# EAGLE design SparkFun_MP3_Breakout-VS1063 (EAGLE 7.2.0)
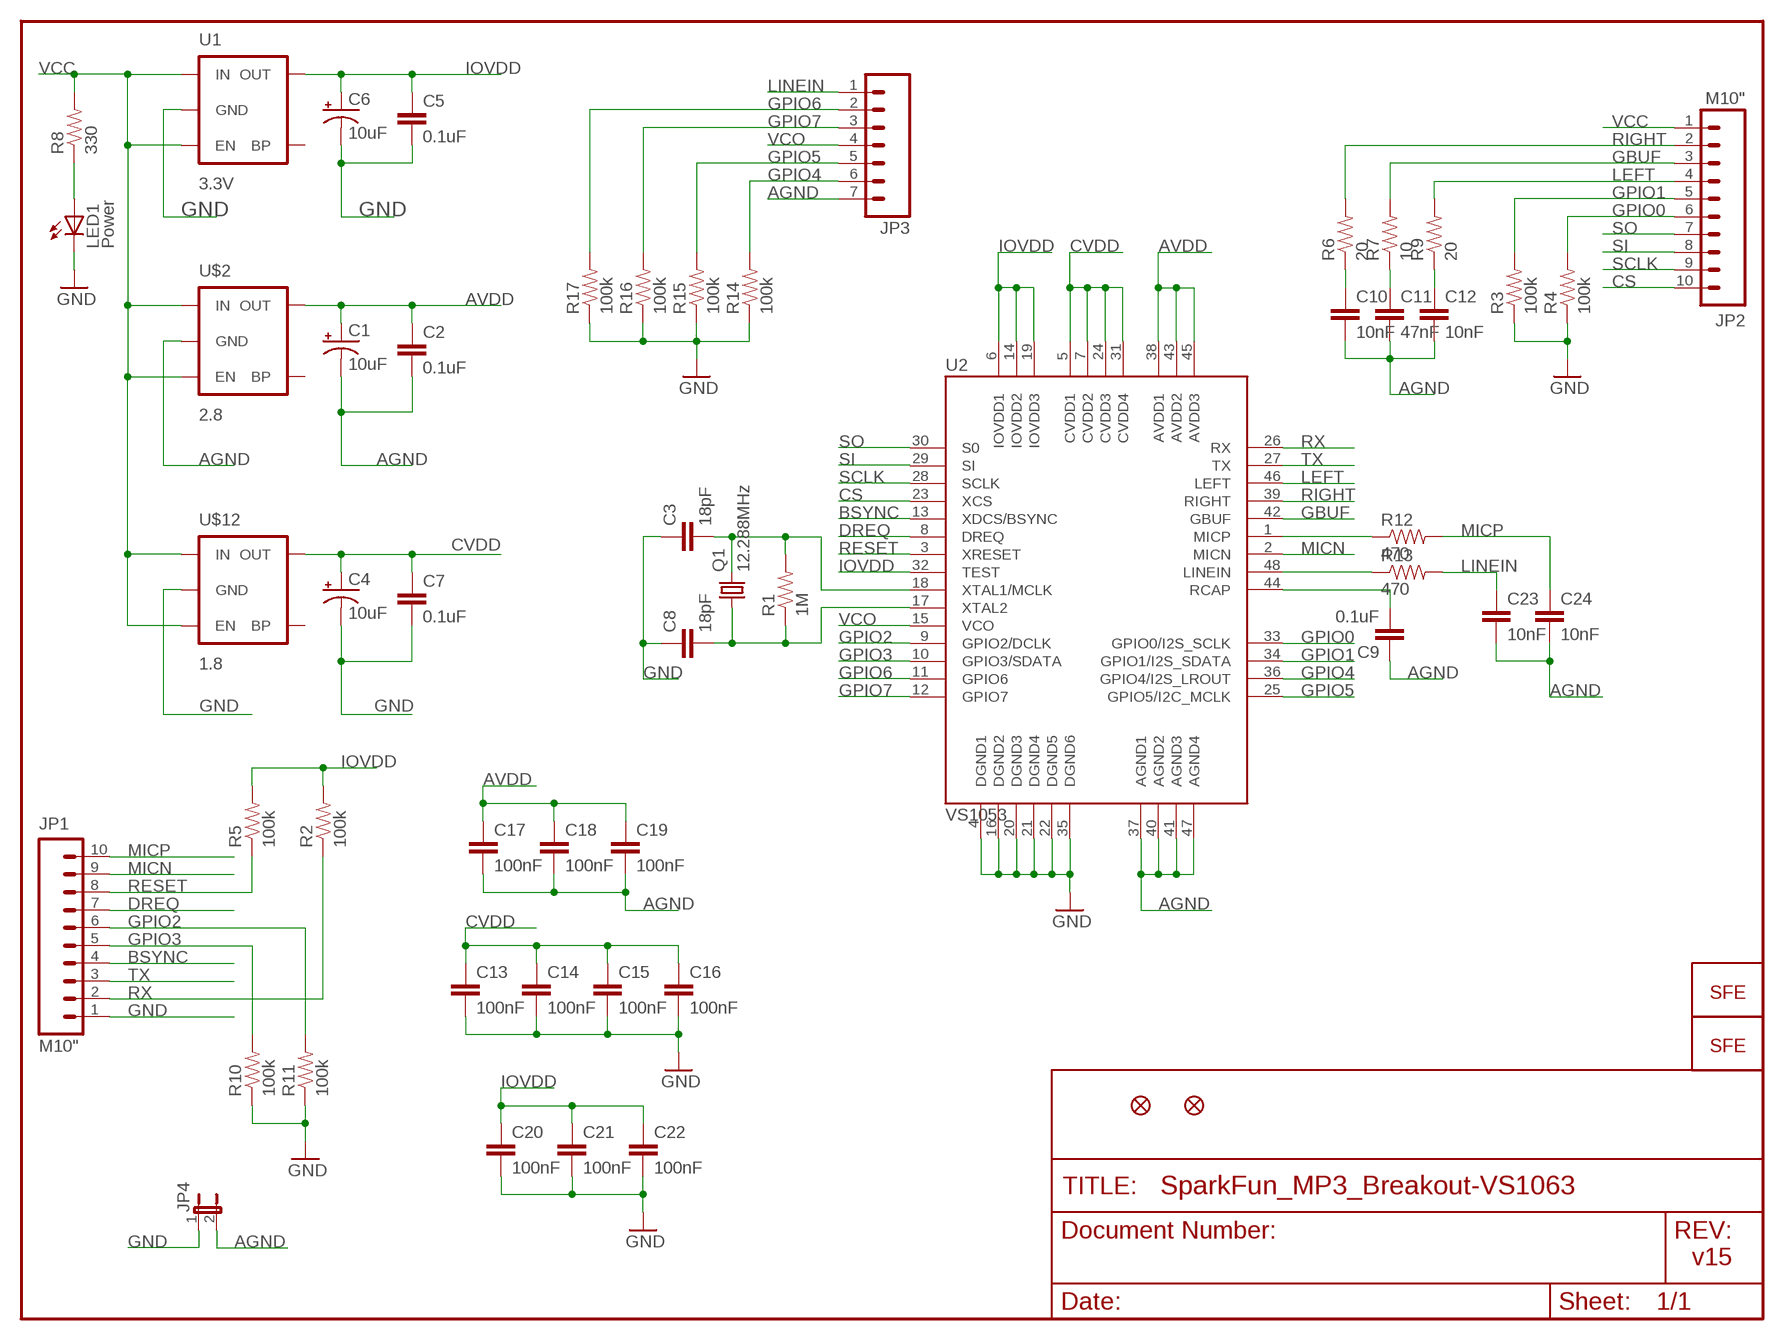
[diagram p0: schematic, sheet 1]

## Parts
C1  10uF  CAP_POL1206  [EIA3216]
C2  0.1uF  CAP0402-CAP  [0402-CAP]
C3  18pF  CAP0402-CAP  [0402-CAP]
C4  10uF  CAP_POL1206  [EIA3216]
C5  0.1uF  CAP0402-CAP  [0402-CAP]
C6  10uF  CAP_POL1206  [EIA3216]
C7  0.1uF  CAP0402-CAP  [0402-CAP]
C8  18pF  CAP0402-CAP  [0402-CAP]
C9  0.1uF  CAP0402-CAP  [0402-CAP]
C10  10nF  CAP0402-CAP  [0402-CAP]
C11  47nF  CAP0402-CAP  [0402-CAP]
C12  10nF  CAP0402-CAP  [0402-CAP]
C13  100nF  CAP0402-CAP  [0402-CAP]
C14  100nF  CAP0402-CAP  [0402-CAP]
C15  100nF  CAP0402-CAP  [0402-CAP]
C16  100nF  CAP0402-CAP  [0402-CAP]
C17  100nF  CAP0402-CAP  [0402-CAP]
C18  100nF  CAP0402-CAP  [0402-CAP]
C19  100nF  CAP0402-CAP  [0402-CAP]
C20  100nF  CAP0402-CAP  [0402-CAP]
C21  100nF  CAP0402-CAP  [0402-CAP]
C22  100nF  CAP0402-CAP  [0402-CAP]
C23  10nF  CAP0402-CAP  [0402-CAP]
C24  10nF  CAP0402-CAP  [0402-CAP]
JP1  M10"  [1X10]
JP2  M10"  [1X10]
JP3  M07  [1X07]
JP4  JUMPER-2SMD-NC  [SJ_2S]
LED1  Power  LED0603  [LED-0603]
Q1  12.288MHz  CRYSTAL5X3  [CRYSTAL-SMD-5X3]
R1  1M  RESISTOR0402-RES  [0402-RES]
R2  100k  RESISTOR0402-RES  [0402-RES]
R3  100k  RESISTOR0402-RES  [0402-RES]
R4  100k  RESISTOR0402-RES  [0402-RES]
R5  100k  RESISTOR0402-RES  [0402-RES]
R6  20  RESISTOR0402-RES  [0402-RES]
R7  10  RESISTOR0402-RES  [0402-RES]
R8  330  RESISTOR0402-RES  [0402-RES]
R9  20  RESISTOR0402-RES  [0402-RES]
R10  100k  RESISTOR0402-RES  [0402-RES]
R11  100k  RESISTOR0402-RES  [0402-RES]
R12  470  RESISTOR0402-RES  [0402-RES]
R13  470  RESISTOR0402-RES  [0402-RES]
R14  100k  RESISTOR0402-RES  [0402-RES]
R15  100k  RESISTOR0402-RES  [0402-RES]
R16  100k  RESISTOR0402-RES  [0402-RES]
R17  100k  RESISTOR0402-RES  [0402-RES]
U1  3.3V  V_REG_LDOSMD  [SOT23-5]
U2  VS1053  VS1033  [LQFP-48]
U$2  2.8  V_REG_LDOSMD2  [SC70]
U$4  FIDUCIAL1X2  [FIDUCIAL-1X2]
U$5  FIDUCIAL1X2  [FIDUCIAL-1X2]
U$6  LOGO-SFESK  [SFE-LOGO-FLAME]
U$7  LOGO-SFENEW  [SFE-NEW-WEBLOGO]
U$12  1.8  V_REG_LDOSMD2  [SC70]

## Nets
AGND: C1.C(-) C2.2 C9.1 C10.2 C11.2 C12.2 C17.2 C18.2 C19.2 C23.2 C24.2 JP3.7 JP4.2 U2.37(AGND1) U2.40(AGND2) U2.41(AGND3) U2.47(AGND4) U$2.2(GND)
AVDD: C1.A(+) C2.1 C17.1 C18.1 C19.1 U2.38(AVDD1) U2.43(AVDD2) U2.45(AVDD3) U$2.5(OUT)
BSYNC: JP1.4 U2.13(XDCS/BSYNC)
CS: JP2.10 U2.23(XCS)
CVDD: C4.A(+) C7.1 C13.1 C14.1 C15.1 C16.1 U2.5(CVDD1) U2.7(CVDD2) U2.24(CVDD3) U2.31(CVDD4) U$12.5(OUT)
DREQ: JP1.7 U2.8(DREQ)
GBUF: JP2.3 R7.2 U2.42(GBUF)
GND: C3.1 C4.C(-) C5.2 C6.C(-) C7.2 C8.1 C13.2 C14.2 C15.2 C16.2 C20.2 C21.2 C22.2 JP1.1 JP4.1 LED1.C R3.1 R4.1 R10.1 R11.1 R14.1 R15.1 R16.1 R17.1 U1.2(GND) U2.4(DGND1) U2.16(DGND2) U2.20(DGND3) U2.21(DGND4) U2.22(DGND5) U2.35(DGND6) U$12.2(GND)
GPIO0: JP2.6 R4.2 U2.33(GPIO0/I2S_SCLK)
GPIO1: JP2.5 R3.2 U2.34(GPIO1/I2S_SDATA)
GPIO2: JP1.6 R11.2 U2.9(GPIO2/DCLK)
GPIO3: JP1.5 R10.2 U2.10(GPIO3/SDATA)
GPIO4: JP3.6 R14.2 U2.36(GPIO4/I2S_LROUT)
GPIO5: JP3.5 R15.2 U2.25(GPIO5/I2C_MCLK)
GPIO6: JP3.2 R17.2 U2.11(GPIO6)
GPIO7: JP3.3 R16.2 U2.12(GPIO7)
IOVDD: C5.1 C6.A(+) C20.1 C21.1 C22.1 R2.2 R5.2 U1.5(OUT) U2.6(IOVDD1) U2.14(IOVDD2) U2.19(IOVDD3) U2.32(TEST)
LEFT: JP2.4 R9.2 U2.46(LEFT)
LINEIN: C23.1 JP3.1 R13.2
MICN: JP1.9 U2.2(MICN)
MICP: C24.1 JP1.10 R12.2
N$1: C9.2 U2.44(RCAP)
N$2: C12.1 R9.1
N$3: C10.1 R6.1
N$4: R12.1 U2.1(MICP)
N$5: C11.1 R7.1
N$6: LED1.A R8.1
N$7: R13.1 U2.48(LINEIN)
N$9: C3.2 Q1.3 R1.2 U2.18(XTAL1/MCLK)
N$10: C8.2 Q1.1 R1.1 U2.17(XTAL2)
RESET: JP1.8 R5.1 U2.3(XRESET)
RIGHT: JP2.2 R6.2 U2.39(RIGHT)
RX: JP1.2 R2.1 U2.26(RX)
SCLK: JP2.9 U2.28(SCLK)
SI: JP2.8 U2.29(SI)
SO: JP2.7 U2.30(S0)
TX: JP1.3 U2.27(TX)
VCC: JP2.1 R8.2 U1.1(IN) U1.3(EN) U$2.1(IN) U$2.3(EN) U$12.1(IN) U$12.3(EN)
VCO: JP3.4 U2.15(VCO)
Unconnected: U1.4(BP) U$2.4(BP) U$12.4(BP)

## Notes on the sheet
- v15

## Library data of the parts
C1 C4 C6 = SparkFun:CAP_POL: Capacitor Polarized These are standard SMD and PTH capacitors. Normally 10uF, 47uF, and 100uF in electrolytic and tantalum varieties. Always verify the external diameter of the through hole cap, it varies with capacity, voltage, and manufacturer. The EIA devices should be standard.
C2 C3 C5 C7-C24 = SparkFun:CAP: Capacitor Standard 0603 ceramic capacitor, and 0.1" leaded capacitor.
JP1 JP2 = SparkFun:M10: Header 10 Standard 10-pin 0.1" header. Use with straight break away headers (SKU : PRT-00116), right angle break away headers (PRT-00553), swiss pins (PRT-00743), machine pins (PRT-00117), and female headers (PRT-00115).
JP3 = SparkFun:M07: Header 7 Standard 7-pin 0.1" header. Use with straight break away headers (SKU : PRT-00116), right angle break away headers (PRT-00553), swiss pins (PRT-00743), machine pins (PRT-00117), and female headers (PRT-00115). NOTES ON THE VARIANTS LOCK and LOCK_LONGPADS... This footprint was designed to help hold the alignment of a through-hole component (i.e. 7-pin header) while soldering it into place. You may notice that each hole has been shifted either up or down by 0.005 of an inch from it's more standard position (which is usually a perfectly straight line). This slight alteration caused the pins (the squares in the middle) to touch the edges of the holes. Because they are alternating, it causes a "brace" to hold the header in place. 0.005 has proven to be the perfect amount of "off-center" position when using our standard breakaway headers. Although looks a little odd when you look at the bare footprint, once you have a header in there, the alteration is very hard to notice. Also, if you push a header all the way into place, it is covered up entirely on the bottom side. This idea of altering the position of holes to aid alignment will be further integrated into the Sparkfun Library for other footprints. It can help hold any component with 3 or more connection pins.
JP4 = SparkFun:JUMPER-2: Jumper Basic 0.1" spaced jumper. Use with breakaway headers.
LED1 = SparkFun:LED: LEDs Standard schematic elements and footprints for 5mm, 3mm, 1206, and 0603 sized LEDs. 5mm - Spark Fun Electronics SKU : COM-00529 (and others)
Q1 = SparkFun:CRYSTAL: Crystals Various standard crystals. Proven footprints. Spark Fun Electronics SKU : COM-00534
R1-R17 = SparkFun:RESISTOR: Resistor Basic schematic elements and footprints for 0603, 1206, and PTH resistors.
U1 U$2 U$12 = SparkFun:V_REG_LDO: Voltage Regulator LDO Standard 150mA LDO voltage regulator in SOT-23 layout. Micrel part MIC5205. BP (by-pass) pin is used to lower output noise with 470pF cap.
U2 = SparkFun:VS1033
U$4 U$5 = SparkFun:FIDUCIAL: Fiducial Alignment Points Various fiducial points for machine vision alignment.
U$6 U$7 = SparkFun:LOGO-SFE: Spark Fun Electronics PCB Logo This is the standard Spark Fun Electronics PCB logo.

## Board
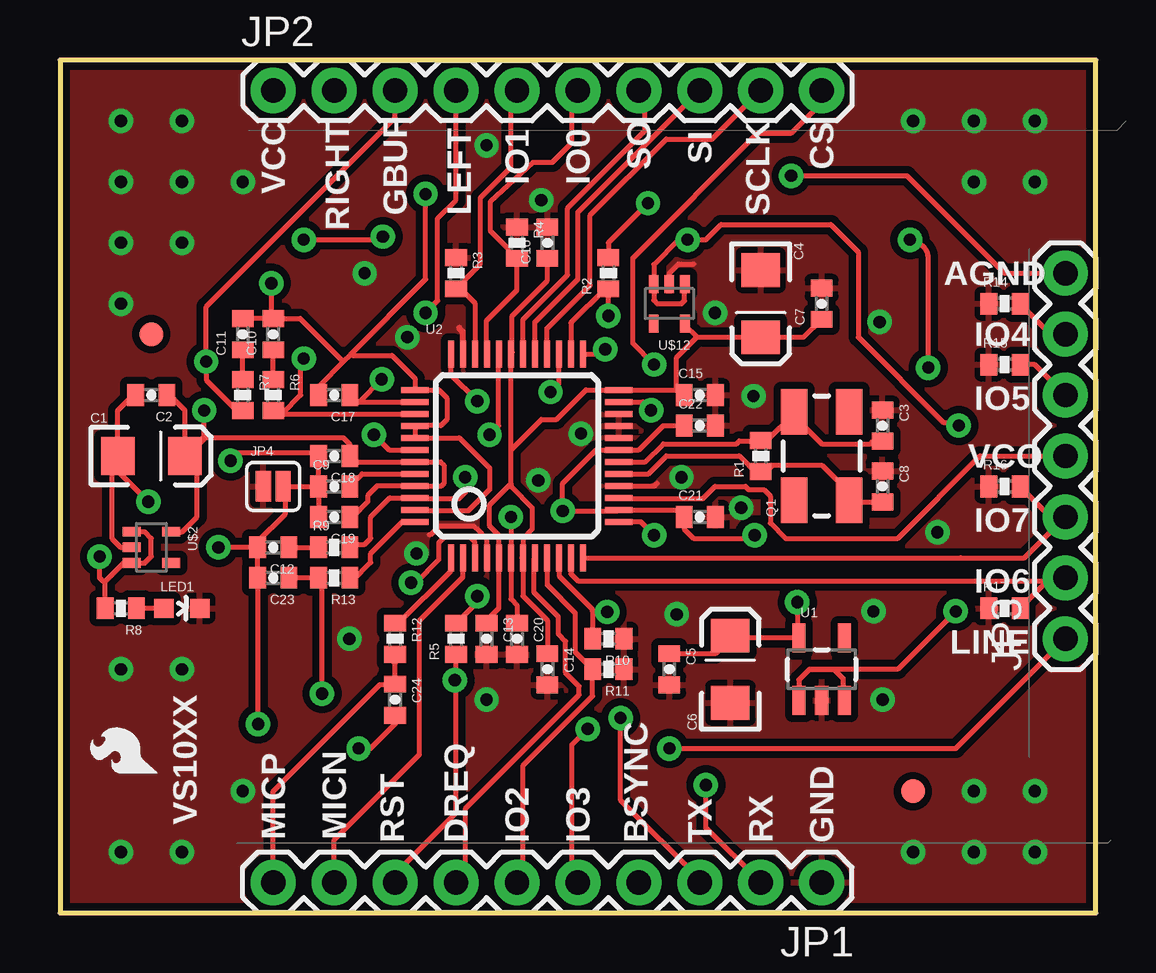
[diagram p1: board, top side]
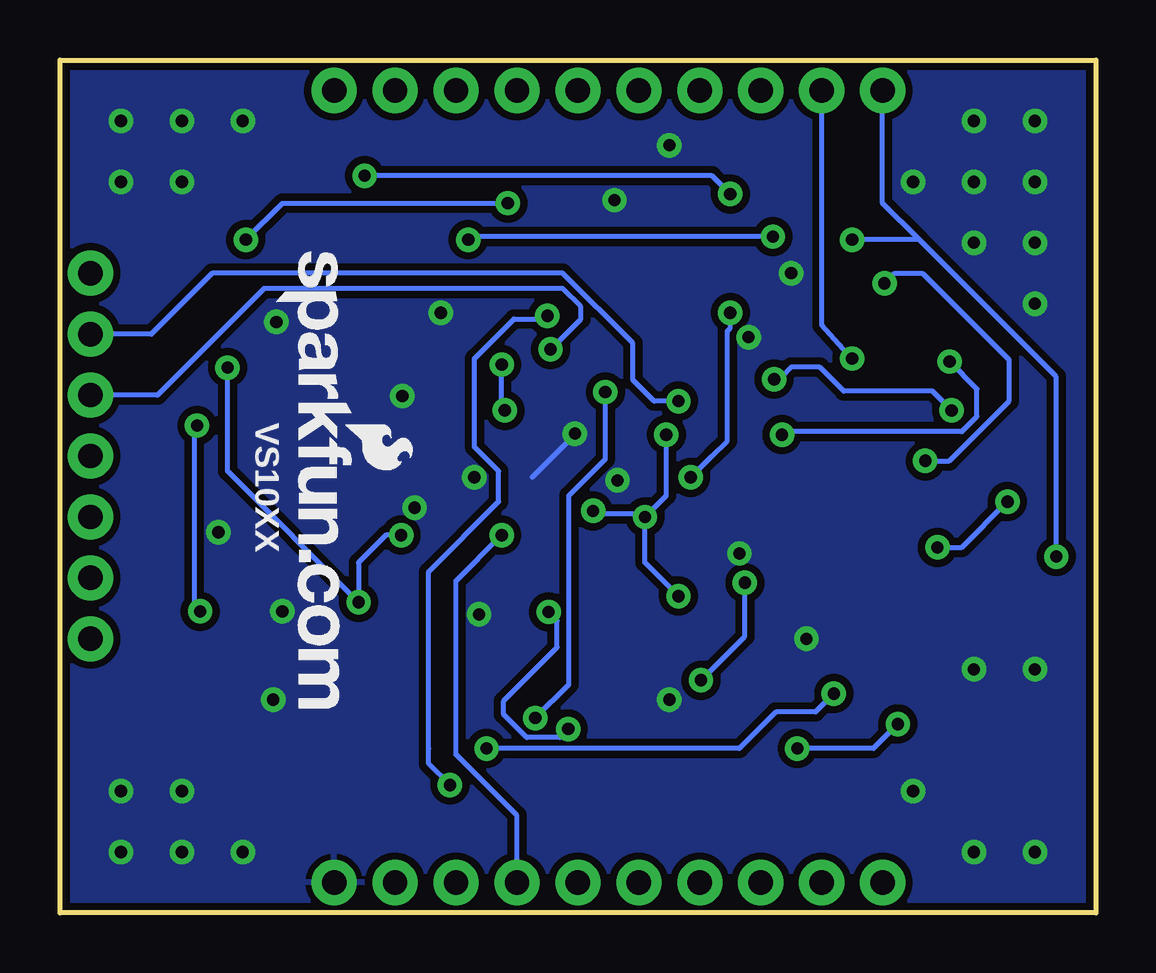
[diagram p2: board, bottom side, seen from below]

Size 43.18 x 35.56 mm. Coordinates in mm from the lower left corner, seen from the top.
Outline: 0,0 43.18,0 43.18,35.56 0,35.56 0,0
Copper layers (1*16): Top 0.035mm / dielectric 1.5mm / Bottom 0.035mm
Design rules "SparkFun": minimum track width 8mil, minimum drill 20mil, track to track 8mil, track to pad 8mil, pad to pad 8mil, via to via 8mil, smd to smd 8mil, copper to edge 9mil, drill to drill 8mil, minimum pad ring 12mil, minimum via ring 10mil, stop-mask expansion 4mil, vias tented up to drill 20mil, thermal gap 10mil

### Footprints (pad centres in the part's own frame; a part is rotated, then mirrored left to right if it is on the bottom)
EIA3216 = smd 1.4 x 1.6: A 1.4,0; C -1.4,0
0402-CAP = smd 0.7 x 0.9: 1 -0.65,0; 2 0.65,0
1X10 = drill 1.016 pad 1.88: 1 0,0; 2 2.54,0; 3 5.08,0; 4 7.62,0; 5 10.16,0; 6 12.7,0; 7 15.24,0; 8 17.78,0; 9 20.32,0; 10 22.86,0
1X07 = drill 1.016 pad 1.88: 1 0,0; 2 2.54,0; 3 5.08,0; 4 7.62,0; 5 10.16,0; 6 12.7,0; 7 15.24,0
SJ_2S = smd 0.635 x 1.27: 1 -0.412,0; 2 0.412,0
LED-0603 = smd 0.8 x 0.8: A 0,-0.75; C 0,0.75
CRYSTAL-SMD-5X3 = smd 1.9 x 1.1: 1 -1.85,-1.15; 2 1.85,-1.15; 3 1.85,1.15; 4 -1.85,1.15
0402-RES = smd 0.7 x 0.9: 1 -0.65,0; 2 0.65,0
SOT23-5 = smd 0.55 x 1.2: 1 -0.95,-1.3; 2 0,-1.3; 3 0.95,-1.3; 4 0.95,1.3; 5 -0.95,1.3
LQFP-48 = smd 0.254 x 1.143: 1 -2.75,-4.25; 2 -2.25,-4.25; 3 -1.75,-4.25; 4 -1.25,-4.25; 5 -0.75,-4.25; 6 -0.25,-4.25; 7 0.25,-4.25; 8 0.75,-4.25; 9 1.25,-4.25; 10 1.75,-4.25; 11 2.25,-4.25; 12 2.75,-4.25; 25 2.75,4.25; 26 2.25,4.25; 27 1.75,4.25; 28 1.25,4.25; 29 0.75,4.25; 30 0.25,4.25; 31 -0.25,4.25; 32 -0.75,4.25; 33 -1.25,4.25; 34 -1.75,4.25; 35 -2.25,4.25; 36 -2.75,4.25 | smd 1.143 x 0.254: 13 4.25,-2.75; 14 4.25,-2.25; 15 4.25,-1.75; 16 4.25,-1.25; 17 4.25,-0.75; 18 4.25,-0.25; 19 4.25,0.25; 20 4.25,0.75; 21 4.25,1.25; 22 4.25,1.75; 23 4.25,2.25; 24 4.25,2.75; 37 -4.25,2.75; 38 -4.25,2.25; 39 -4.25,1.75; 40 -4.25,1.25; 41 -4.25,0.75; 42 -4.25,0.25; 43 -4.25,-0.25; 44 -4.25,-0.75; 45 -4.25,-1.25; 46 -4.25,-1.75; 47 -4.25,-2.25; 48 -4.25,-2.75
SC70 = smd 0.4 x 0.75: 1 -0.65,-0.825; 2 0,-0.825; 3 0.65,-0.825; 4 0.65,0.825; 5 -0.65,0.825
FIDUCIAL-1X2 = smd 1 x 1: 1 0,0

### Placement (x,y rotation side)
C1  3.81,19.05 0 top
C2  3.81,21.59 180 top
C3  34.29,20.32 270 top
C4  29.21,25.4 270 top
C5  25.4,10.16 270 top
C6  27.94,10.16 90 top
C7  31.75,25.4 90 top
C8  34.29,17.78 270 top
C9  11.43,17.78 0 top
C10  8.89,24.13 90 top
C11  7.62,24.13 90 top
C12  8.89,15.24 180 top
C13  17.78,11.43 270 top
C14  20.32,10.16 270 top
C15  26.67,21.59 0 top
C16  20.32,27.94 90 top
C17  11.43,21.59 180 top
C18  11.43,19.05 180 top
C19  11.43,16.51 180 top
C20  19.05,11.43 270 top
C21  26.67,16.51 0 top
C22  26.67,20.32 0 top
C23  8.89,13.97 180 top
C24  13.97,8.89 270 top
JP1  31.75,1.27 180 top
JP2  8.89,34.29 0 top
JP3  41.91,11.43 90 top
JP4  8.89,17.78 0 top
LED1  5.08,12.7 270 top
Q1  31.75,19.05 90 top
R1  29.21,19.05 90 top
R2  22.86,26.67 90 top
R3  16.51,26.67 270 top
R4  19.05,27.94 270 top
R5  16.51,11.43 90 top
R6  8.89,21.59 270 top
R7  7.62,21.59 270 top
R8  2.54,12.7 180 top
R9  11.43,15.24 0 top
R10  22.86,11.43 180 top
R11  22.86,10.16 180 top
R12  13.97,11.43 270 top
R13  11.43,13.97 180 top
R14  39.37,25.4 0 top
R15  39.37,22.86 0 top
R16  39.37,17.78 0 top
R17  39.37,12.7 0 top
U1  31.75,10.16 0 top
U2  19.05,19.05 0 top
U$2  3.81,15.24 270 top
U$4  35.56,5.08 0 top
U$5  3.81,24.13 0 top
U$6  4.06,5.84 90 top
U$7  34.16,27.56 270 bottom
U$12  25.4,25.4 180 top

### Tracks (layer width: path | path; a pad name or v marks a point on that pad's centre or on a via)
AGND  (via drill 0.51)
  Top 0.203: U$2.2 2.54,15.24 2.16,15.62 2.16,18.54 | 2.41,19.17 2.41,19.18 | 2.41,19.17 C1.C 2.41,20.95 3.05,21.59 C2.2 | 2.16,18.54 2.16,18.92 2.41,19.17 | C12.2 v6.6,15.24 | 2.16,18.54 2.29,18.54 v3.68,17.14 | C12.2 8.24,15.48 9.4,16.64 9.4,17.65 9.34,17.71 JP4.2 | C9.1 10.79,17.78 10.78,17.77 C19.2 | JP4.2 9.27,17.78 | JP4.2 C9.1 | 10.78,19.07 C18.2 | C9.1 10.78,19.07 | 10.78,19.07 10.67,19.18 7.44,19.18 v7.11,18.85 | C12.2 8.26,15.24 8.24,15.22 C23.2 8.24,13.73 8.26,13.72 v8.26,7.87 | C11.2 7.62,24.77 7.63,24.78 C10.2 | 10.79,21.97 10.79,21.84 10.78,21.83 C17.2 10.78,21.96 10.79,21.97 | 14.75,20.3 14.73,20.32 | 14.75,20.3 U2.40 14.97,20.3 14.99,20.32 15.88,20.32 16.13,20.57 16.13,21.46 15.79,21.8 U2.37 14.8,22.28 13.84,23.24 12.19,23.24 12.13,23.3 | 14.75,20.3 14.8,20.25 U2.41 16.65,19.8 17.91,18.54 17.91,17.65 17.02,16.76 14.86,16.76 14.82,16.8 U2.47 | v15.24,29.97 15.24,26.42 12.13,23.3 | 11.81,22.99 12.13,23.3 | 11.81,22.99 10.79,21.97 | C10.2 8.78,24.78 8.71,24.85 8.81,24.95 v8.81,26.25 | v30.48,30.73 35.31,30.73 39.37,26.67 JP3.7 | C24.2 13.97,7.87 12.95,6.86 v12.45,6.86 | C10.2 10.02,24.78 11.81,22.99
  Bottom 0.203: v6.6,15.24 5.59,15.24 v3.68,17.14 | v12.45,6.86 9.27,6.86 v8.26,7.87 | v30.48,30.73 16,30.73 v15.24,29.97 | v7.11,18.85 6.11,18.85 3.61,21.35 3.61,23.05 7.21,26.65 8.41,26.65 v8.81,26.25
AVDD  (via drill 0.51)
  Top 0.203: 12.06,19.05 C18.1 | 12.06,19.05 12.31,18.8 U2.43 15.87,18.8 16,18.67 16,17.91 15.88,17.78 14.99,17.78 14.97,17.8 U2.45 13.23,17.8 12.83,17.4 12.83,17.14 12.19,16.51 C19.1 | C17.1 12.08,21.57 12.36,21.3 | 12.36,21.3 U2.38 | C2.1 4.57,21.59 5.21,20.95 C1.A | U$2.5 5.09,15.89 5.71,16.51 5.71,18.67 5.33,19.05 5.31,19.05 | 12.06,19.05 12.06,19.56 11.81,19.81 5.97,19.81 C1.A | 5.31,19.05 5.46,19.05 5.71,19.3 | 12.36,21.3 12.46,21.3 v13.41,22.25 | 5.31,19.05 C1.A | v6.01,20.95 6.01,19.75 5.31,19.05
  Bottom 0.203: v13.41,22.25 13.11,22.35 12.71,22.75 11.51,22.75 10.51,21.75 6.81,21.75 v6.01,20.95
BSYNC  (via drill 0.51)
  Top 0.203: v24.77,15.75 24.21,16.3 U2.13
  Bottom 0.203: JP1.4 24.13,4.06 26.67,6.6 26.67,13.84 v24.77,15.75
CS  (via drill 0.51)
  Top 0.203: v24.77,22.86 23.88,23.75 23.88,27.3 29.08,32.51 30.48,32.51 31.75,33.78 JP2.10 | U2.23 24.29,21.3 v24.64,20.95
  Bottom 0.203: v24.77,22.86 24.77,21.08 v24.64,20.95
CVDD
  Top 0.203: C15.1 25.91,21.59 25.7,21.8 | 25.7,21.8 U2.24 21.93,21.8 20.7,20.57 20.07,20.57 18.8,19.3 | C14.1 20.32,12.19 19.3,13.21 U2.7 19.25,14.8 19.3,14.86 19.3,15.62 19.68,16 19.68,16.89 18.8,17.78 18.8,17.91 | C13.1 17.78,12.19 18.3,12.71 U2.5 18.3,15.74 17.91,16.13 17.91,17.02 18.8,17.91 | U$12.5 26.05,24.53 26.04,24.51 26.54,24 | 26.54,24 26.55,24 C4.A 30.98,24 31.75,24.77 C7.1 | 25.7,21.8 25.7,23.16 26.54,24 | 18.8,17.91 18.8,19.3 | 18.8,19.3 U2.31 18.85,23.37 18.85,24.89 20.32,26.36 C16.1
DREQ
  Top 0.203: JP1.7 16.92,1.68 16.92,4.37 21.64,9.09 21.64,9.45 21.08,10.01 21.08,11.33 20.78,11.63 20.78,12.34 19.76,13.36 19.76,14.78 U2.8
GBUF  (via drill 0.51)
  Top 0.203: 7.49,20.7 7.62,20.83 R7.2 | JP2.3 13.97,33.15 6.1,25.27 v6.1,22.99 6.1,22.23 7.37,20.95 | R7.2 7.61,20.94 7.49,20.83 7.37,20.95 | 7.37,20.95 7.38,20.94 R7.2 | U2.42 13.72,19.3 v13.08,19.94
  Bottom 0.203: v6.1,22.99 4.95,21.84 4.95,20.7 5.59,20.07 12.95,20.07 v13.08,19.94
GND  (via drill 0.51)
  Top 0.203: U2.16 24.79,17.8 24.89,17.91 | U$12.2 25.4,26.67 25.78,27.05 26.42,27.05 | U2.4 17.8,15.6 17.4,16 17.32,16.05 17.27,16.1 15.8,16.1 15.49,15.8 15.4,15.77
  Top 0.254: U2.35 16.8,24.22 16.64,24.38
  Bottom 0.203: 21.72,19.94 23.5,18.16
  other vias: 25.71,12.45 28.91,21.55 21.71,19.98 14.48,24 17.78,32 17.78,8.89 33.91,12.57 34.29,8.89 34.16,24.64 27.3,25.02 12.7,26.67 25.91,18.16 28.4,16.89 19.94,18.03 14.86,14.99 12.06,11.43 2.54,33.02 5.08,33.02 7.62,30.48 5.08,30.48 2.54,27.94 2.54,30.48 5.08,27.94 2.54,25.4 2.54,10.16 5.08,10.16 7.62,5.08 5.08,2.54 2.54,2.54 38.1,33.02 35.56,33.02 38.1,5.08 38.1,2.54 35.56,2.54 20.07,29.72 36.58,15.88 38.1,30.48 40.64,30.48 40.64,33.02 40.64,5.08 40.64,2.54
  pour Bottom (isolate 0.305): 0,35.56 0,0 43.18,0 43.18,35.56
  pour Top (isolate 0.305): 0,35.56 0,0 43.18,0 43.18,35.56
GPIO0
  Top 0.203: U2.33 17.78,23.32 17.78,24.69 19.05,25.96 R4.2 19,27.38 17.96,28.42 17.96,29.67 19.71,31.29 20.52,31.29 21.34,32.11 21.34,34.04 JP2.6
GPIO1
  Top 0.203: U2.34 17.32,23.32 17.32,25.4 16.6,26.12 | JP2.5 18.8,34.04 18.8,31.09 17.53,29.82 17.53,27.05 R3.2 16.6,26.12 | 16.6,26.12 16.53,26.19
GPIO2
  Top 0.203: U2.9 20.32,14.78 20.32,13.66 21.49,12.5 21.49,10.87 R11.2 22.2,10.11 22.2,9.04 19.3,6.15 19.3,1.52 JP1.6
GPIO3  (via drill 0.51)
  Top 0.203: 22.2,12.55 22.2,12.65 20.83,14.02 20.83,14.78 U2.10 | 22.2,12.55 R10.2 | v22.81,12.55 22.25,12.55 22.2,12.55 | v22,7.67 21.34,7.01 21.34,1.52 JP1.5
  Bottom 0.203: v22.81,12.55 22.45,12.19 22.45,11.07 24.69,8.84 24.69,8.28 23.72,7.32 22.35,7.32 v22,7.67
GPIO4  (via drill 0.51)
  Top 0.203: U2.36 16.3,22.43 v17.4,21.34 | R14.2 41.29,24.13 JP3.6
  Bottom 0.203: v17.4,21.34 18.41,21.34 19.3,22.23 19.3,23.75 22.23,26.67 36.83,26.67 39.37,24.13 JP3.6 42.04,24
GPIO5  (via drill 0.51)
  Top 0.203: U2.25 22.54,23.3 v22.73,23.5 | R15.2 40.64,22.86 JP3.5
  Bottom 0.203: 41.78,21.46 JP3.5 39.12,21.59 34.67,26.04 22.23,26.04 21.46,25.27 21.46,24.77 v22.73,23.5
GPIO6
  Top 0.203: U2.11 21.3,14.13 21.59,13.84 42.04,13.84 JP3.2 41.29,13.97 R17.2
GPIO7
  Top 0.203: JP3.3 41.78,16.51 | U2.12 37.53,14.8 40.2,14.8 JP3.3 | R16.2 41.29,16.51 JP3.3
IOVDD  (via drill 0.51)
  Top 0.203: C22.1 25.15,20.32 24.13,19.3 U2.19 22.35,19.3 20.95,17.91 v20.95,16.76 23.24,16.76 23.28,16.8 U2.14 25.75,16.8 26.04,16.51 C21.1 26.02,16.02 26.42,15.62 28.96,15.62 v28.96,15.75 | C5.1 27.32,10.81 28.07,11.56 | 28.07,11.56 28.06,11.56 C6.A | 28.07,11.56 28.16,11.46 U1.5 30.8,11.62 30.73,11.68 v30.73,12.95 | v18.8,16.51 18.8,16.25 U2.6 18.8,13.08 19.05,12.83 C20.1 | R2.2 22.86,27.94 v24.51,29.59 | v35.43,28.07 arc90 35.56,27.94 arc-90 36.2,27.3 v36.2,22.73 | v17.91,19.94 18.29,20.32 18.29,23.29 U2.32 | R5.2 17.4,12.97 v17.4,13.21
  Bottom 0.203: v28.96,15.75 29.59,15.75 30.73,14.61 v30.73,12.95 36.2,18.41 v36.2,22.73 | v18.8,16.51 19.05,16.64 20.83,16.64 v20.95,16.76 | v24.51,29.59 33.91,29.59 v35.43,28.07 | v18.8,16.51 17.91,17.4 v17.91,19.94 | v17.4,13.21 18.8,14.61 | 18.8,14.61 18.8,15.88 | 18.8,14.61 v18.8,16.51
LEFT  (via drill 0.51)
  Top 0.203: R9.2 12.19,15.24 12.32,15.37 12.7,15.37 12.95,15.62 12.95,16.51 13.74,17.3 U2.46 14.83,17.3 14.86,17.27 16.64,17.27 16.89,17.53 v16.89,18.16 | JP2.4 16.51,29.72 15.75,28.96 15.75,25.53 v15.24,25.02
  Bottom 0.203: v16.89,18.16 16,19.05 15.37,19.68 15.37,24.26 15.24,24.38 v15.24,25.02
LINEIN  (via drill 0.51)
  Top 0.203: 9.53,13.97 C23.1 R13.2 10.79,13.97 10.92,13.84 v10.92,9.14 | v25.4,6.86 34.8,6.86 37.34,6.86 JP3.1
  Bottom 0.203: v25.4,6.86 14.86,6.86 13.34,8.38 11.68,8.38 v10.92,9.14
MICN
  Top 0.203: U2.2 16.8,14.01 15.88,13.08 14.99,12.19 14.99,6.6 11.43,3.05 JP1.9
MICP
  Top 0.203: JP1.10 8.89,5.08 13.34,9.53 13.97,9.53 C24.1 13.97,10.41 13.84,10.54 13.97,10.67 R12.2
N$1
  Top 0.203: C9.2 12.08,17.8 12.59,18.3 U2.44
N$2
  Top 0.203: 9.53,15.24 C12.1 R9.1
N$3
  Top 0.203: C10.1 8.89,23.37 8.91,23.35 8.89,23.33 R6.1
N$4
  Top 0.203: R12.1 14.08,12.08 14.1,12.06 16.3,14.27 U2.1
N$5
  Top 0.203: C11.1 7.62,23.44 7.71,23.35 7.62,23.26 R7.1
N$6
  Top 0.203: LED1.A 4.33,12.67 4.21,12.55 4.06,12.7 R8.1
N$7
  Top 0.203: U2.48 14.27,16.3 12.95,14.99 12.95,14.61 12.19,13.84 12.08,13.96 R13.1
N$9
  Top 0.203: C3.2 33.89,19.67 33.78,19.56 31.75,19.56 30.6,20.71 Q1.3 30.6,20.84 30.61,20.83 29.48,19.7 R1.2 29.1,19.7 29.08,19.68 28.32,19.68 28.19,19.56 25.15,19.56 24.39,18.8 U2.18
N$10
  Top 0.203: 29.08,18.29 29.07,18.3 | C8.2 33.03,17.13 32.97,17.2 Q1.1 32.9,17.52 31.75,18.67 29.72,18.67 29.45,18.4 R1.1 29.2,18.4 29.08,18.29 | U2.17 24.52,18.3 25.27,19.05 28.32,19.05 29.08,18.29
RESET  (via drill 0.51)
  Top 0.203: 16.51,9.7 16.51,4.17 13.97,1.63 JP1.8 | 16.51,9.7 R5.1 | v14.63,13.77 14.83,13.77 15.8,14.73 15.8,15.44 16.05,15.7 17.07,15.7 17.27,15.49 17.27,14.88 U2.3 | 16.51,9.7 v16.46,9.7
  Bottom 0.203: v14.63,13.77 14.63,11.53 v16.46,9.7
RIGHT  (via drill 0.51)
  Top 0.203: U2.39 9.17,20.8 9.02,20.95 9,20.94 R6.2 9.16,20.94 9.27,20.83 10.03,21.59 10.03,22.99 v10.16,23.11
  Bottom 0.203: JP2.2 11.43,24.51 v10.16,23.11
RX  (via drill 0.51)
  Top 0.203: U2.26 21.3,24.6 22.73,26.04 22.75,26.02 R2.1 22.88,26.02 22.99,25.91 22.86,25.78 v22.86,24.89 | JP1.2 26.92,3.56 v26.92,5.33
  Bottom 0.203: v22.86,24.89 22.99,24.77 24.26,24.77 25.84,23.18 25.91,23.11 25.91,19.43 24.89,18.41 24.89,17.14 27.81,14.22 27.81,6.86 27.81,6.22 v26.92,5.33
SCLK
  Top 0.203: U2.28 20.3,24.36 22.1,26.16 22.1,29.08 25.27,32.26 27.18,32.26 JP2.9
SI
  Top 0.203: U2.29 19.8,24.63 21.59,26.42 21.59,29.21 JP2.8 26.42,34.29 26.29,34.42
SO
  Top 0.203: JP2.7 24.38,34.04 24.38,32.61 21.16,29.39 21.16,26.59 19.3,24.74 19.3,23.32 U2.30
TX  (via drill 0.51)
  Top 0.203: U2.27 20.8,22.07 v20.45,21.72 | v23.37,8.13 23.37,4.7 26.67,1.4 JP1.3
  Bottom 0.203: v20.45,21.72 20.45,18.92 21.97,17.4 21.97,9.53 v23.37,8.13
VCC  (via drill 0.51)
  Top 0.203: R8.2 1.89,13.83 | 1.89,13.83 2.67,14.61 2.68,14.59 U$2.3 3.54,14.59 3.81,14.86 3.81,15.62 3.56,15.88 3.05,15.88 3.03,15.89 U$2.1 | U$12.1 26.05,26.18 26.04,26.16 26.04,25.53 25.91,25.4 24.89,25.4 24.75,25.54 U$12.3 24.75,27.04 25.78,28.07 v26.16,28.07 26.92,28.07 27.56,28.7 32.13,28.7 33.27,27.56 33.27,24 36.83,20.45 37.34,20.45 v37.47,20.32 | U1.1 30.8,9.72 31.24,10.16 | 31.24,10.16 32.26,10.16 32.64,9.78 32.64,8.89 32.7,8.83 | 32.7,8.83 32.77,8.76 | 32.7,8.83 U1.3 | 1.89,13.83 1.79,13.83 1.65,13.97 v1.65,14.86 | 31.24,10.16 34.92,10.16 v37.34,12.57 | v10.16,28.07 13.34,28.07 v13.46,28.19
  Bottom 0.203: JP2.1 8.89,29.59 7.37,28.07 | 7.37,28.07 1.65,22.35 v1.65,14.86 | 7.37,28.07 v10.16,28.07 | v37.47,20.32 37.59,20.19 37.59,12.83 v37.34,12.57 | v13.46,28.19 26.04,28.19 v26.16,28.07
VCO
  Top 0.203: 41.78,19.05 JP3.4 38.35,19.05 34.92,15.62 30.24,15.62 29.61,16.25 29.61,17.38 29.34,17.65 28.7,17.65 28.57,17.78 27.3,17.78 26.8,17.27 23.37,17.27 23.34,17.3 U2.15

### Text on the board
tPlace: SO | SI | CS | VCC | IO1 | IO0 | GBUF | LEFT | SCLK | RIGHT | AGND | IO4 | IO5 | VCO | IO7 | IO6 | LINE | VS10XX | MICP | MICN | RST | DREQ | IO2 | IO3 | BSYNC | TX | RX | GND
bPlace: VS10XX